# EAGLE schematic Probatio5Pins_v0.0.2 (EAGLE 7.4.0)
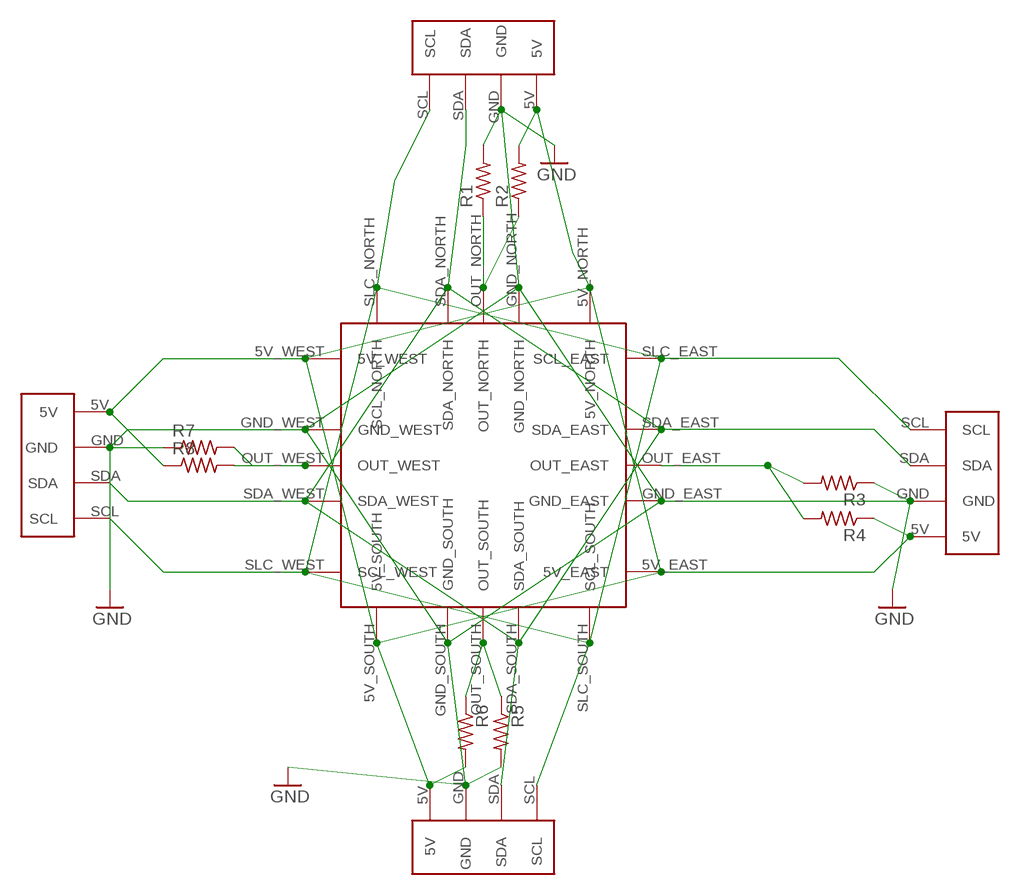
[diagram p0: schematic, sheet 1]

## Parts
CENTER1  CONNECTORS_PIN_DEVICE  [CONNECTORS_PIN]
R1  R-US_R0805  [R0805]
R2  R-US_R0805  [R0805]
R3  R-US_R0805  [R0805]
R4  R-US_R0805  [R0805]
R5  R-US_R0805  [R0805]
R6  R-US_R0805  [R0805]
R7  R-US_R0805  [R0805]
R8  R-US_R0805  [R0805]
U$1  FOUR_SIDE_PINS  [FOUR_SIDE_PINS]
U$2  FOUR_SIDE_PINS  [FOUR_SIDE_PINS]
U$3  FOUR_SIDE_PINS  [FOUR_SIDE_PINS]
U$4  FOUR_SIDE_PINS  [FOUR_SIDE_PINS]

## Nets
GND: CENTER1.GND_EAST CENTER1.GND_NORTH CENTER1.GND_SOUTH CENTER1.GND_WEST R1.2 R3.1 R5.2 R7.1 U$1.GND U$2.GND U$3.GND U$4.GND
N$3: CENTER1.OUT_EAST R3.2 R4.2
N$4: CENTER1.SDA_EAST CENTER1.SDA_NORTH CENTER1.SDA_SOUTH CENTER1.SDA_WEST U$1.SDA U$2.SDA U$3.SDA U$4.SDA
N$6: CENTER1.5V_EAST CENTER1.5V_NORTH CENTER1.5V_SOUTH CENTER1.5V_WEST R2.2 R4.1 R6.2 R8.1 U$1.5V U$2.5V U$3.5V U$4.5V
N$7: CENTER1.OUT_NORTH R1.1 R2.1
N$10: CENTER1.SLC_EAST(SCL_EAST) CENTER1.SLC_NORTH(SCL_NORTH) CENTER1.SLC_SOUTH(SCL_SOUTH) CENTER1.SLC_WEST(SCL_WEST) U$1.SCL U$2.SCL U$3.SCL U$4.SCL
N$15: CENTER1.OUT_WEST R7.2 R8.2
N$18: CENTER1.OUT_SOUTH R5.1 R6.1

## Library data of the parts
CENTER1 = probatioBase5Pins_0.0.2:CONNECTORS_PIN_DEVICE: Bottom Contact Probatio contact for slots on the base. This version has 5 pins
R1-R8 = resistor:R-US_: RESISTOR, American symbol
U$1-U$4 = probatio_fourSidePins:FOUR_SIDE_PINS